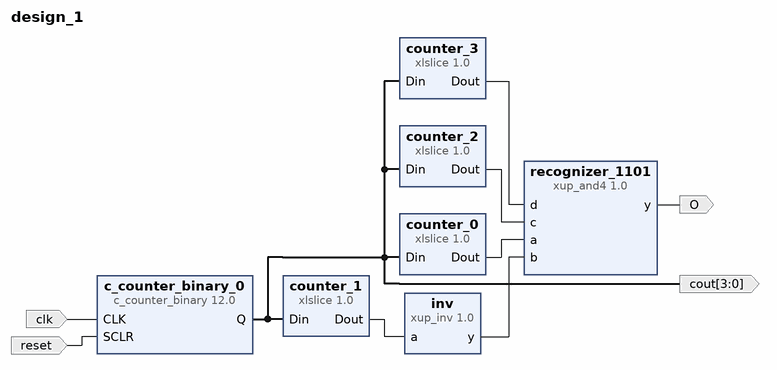
[diagram p0: block diagram of the top level]
# Vivado block design design_1, xc7a35tcpg236-1, Vivado 2023.1
create_bd_design design_1

create_bd_port -dir I clk
create_bd_port -dir I reset
create_bd_port -dir O -from 3 -to 0 cout
create_bd_port -dir O O

create_bd_cell -type ip -vlnv xilinx.com:ip:c_counter_binary:12.0 c_counter_binary_0
set_property -dict {CONFIG.CE false CONFIG.Output_Width 4 CONFIG.SCLR true} [get_bd_cells c_counter_binary_0]
create_bd_cell -type ip -vlnv xilinx.com:ip:xlslice:1.0 counter_0
set_property -dict {CONFIG.DIN_FROM 0 CONFIG.DIN_TO 0 CONFIG.DIN_WIDTH 4} [get_bd_cells counter_0]
create_bd_cell -type ip -vlnv xilinx.com:ip:xlslice:1.0 counter_1
set_property -dict {CONFIG.DIN_FROM 1 CONFIG.DIN_TO 1 CONFIG.DIN_WIDTH 4} [get_bd_cells counter_1]
create_bd_cell -type ip -vlnv xilinx.com:ip:xlslice:1.0 counter_2
set_property -dict {CONFIG.DIN_FROM 2 CONFIG.DIN_TO 2 CONFIG.DIN_WIDTH 4} [get_bd_cells counter_2]
create_bd_cell -type ip -vlnv xilinx.com:ip:xlslice:1.0 counter_3
set_property -dict {CONFIG.DIN_FROM 3 CONFIG.DIN_TO 3 CONFIG.DIN_WIDTH 4} [get_bd_cells counter_3]
create_bd_cell -type ip -vlnv xilinx.com:XUP:xup_and4:1.0 recognizer_1101
create_bd_cell -type ip -vlnv xilinx.com:XUP:xup_inv:1.0 inv

# ---- connections ----

connect_bd_net [get_bd_pins c_counter_binary_0/Q] \
  [get_bd_ports cout] [get_bd_pins counter_0/Din] [get_bd_pins counter_1/Din] [get_bd_pins counter_2/Din] \
  [get_bd_pins counter_3/Din]
connect_bd_net [get_bd_ports clk] [get_bd_pins c_counter_binary_0/CLK]
connect_bd_net [get_bd_ports reset] [get_bd_pins c_counter_binary_0/SCLR]
connect_bd_net -net xlslice_0_Dout [get_bd_pins counter_0/Dout] [get_bd_pins recognizer_1101/a]
connect_bd_net -net xlslice_1_Dout [get_bd_pins counter_1/Dout] [get_bd_pins inv/a]
connect_bd_net -net xlslice_2_Dout [get_bd_pins counter_2/Dout] [get_bd_pins recognizer_1101/c]
connect_bd_net -net xlslice_3_Dout [get_bd_pins counter_3/Dout] [get_bd_pins recognizer_1101/d]
connect_bd_net -net xup_and4_0_y [get_bd_pins recognizer_1101/y] [get_bd_ports O]
connect_bd_net -net xup_inv_0_y [get_bd_pins inv/y] [get_bd_pins recognizer_1101/b]

validate_bd_design
save_bd_design
